# Altium schematic sheet E17-03-VCU.SchDoc
size A4
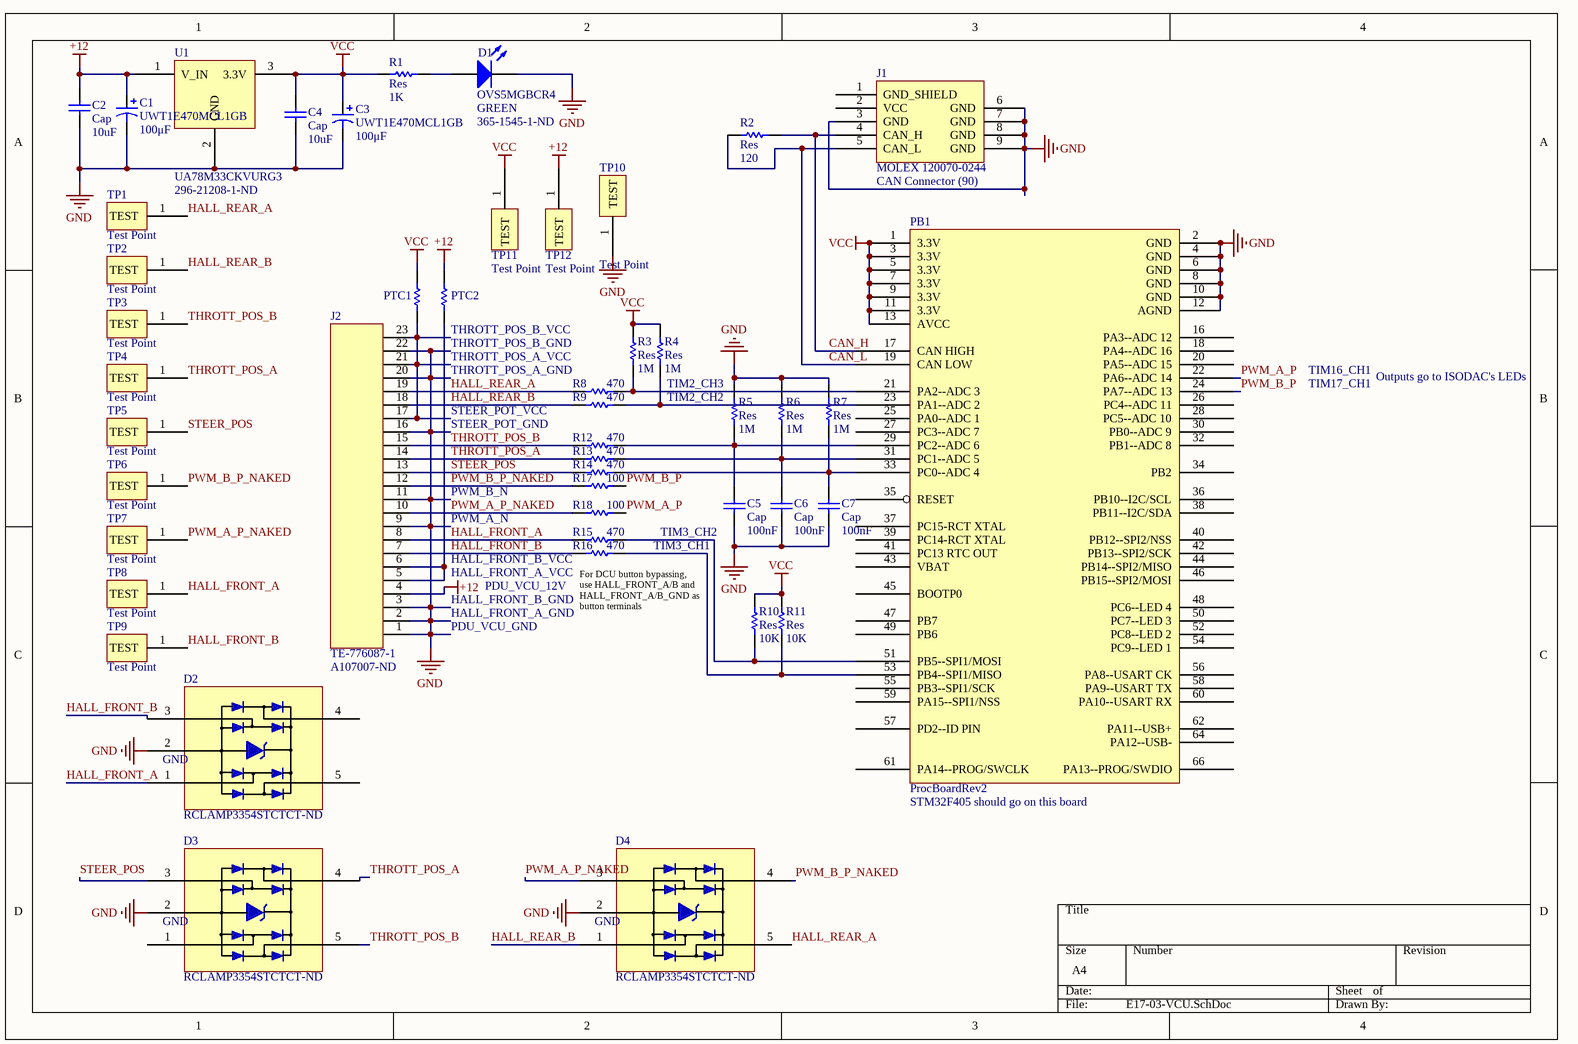
[diagram p0: E17-03-VCU.SchDoc]

## Parts
C1  UWT1E470MCL1GB  value 100μF  [UWT1E470MCL1GB]
C2  Cap  value 10uF  [C0805]
C3  UWT1E470MCL1GB  value 100μF  [UWT1E470MCL1GB]
C4  Cap  value 10uF  [C0805]
C5  Cap  value 100nF  [C0805]
C6  Cap  value 100nF  [C0805]
C7  Cap  value 100nF  [C0805]
D1  OVS5MGBCR4  Colour: GREEN  Supplier Part Number 1: 365-1545-1-ND  [OVS5MGBCR4]
D2  Supplier Part Number 1: RCLAMP3354STCTCT-ND  [SOT95P280X145-5N]  (hidden comment: RCLAMP3354S.TCT)
D3  Supplier Part Number 1: RCLAMP3354STCTCT-ND  [SOT95P280X145-5N]  (hidden comment: RCLAMP3354S.TCT)
D4  Supplier Part Number 1: RCLAMP3354STCTCT-ND  [SOT95P280X145-5N]  (hidden comment: RCLAMP3354S.TCT)
J1  CAN Connector (90)  [CAN Connector (90)]
J2  TE-776087-1  Supplier Part Number 1: A107007-ND  [TE-776087-1]
PB1  ProcBoardRev2  [PROC_BOARD]
PTC1  1206L075/16WR  [3216[1206]]  (value not drawn)
PTC2  1206L075/16WR  [3216[1206]]  (value not drawn)
R1  Res  value 1K  [2012[0805]]
R2  Res  value 120  [2012[0805]]
R3  Res  value 1M  [2012[0805]]
R4  Res  value 1M  [2012[0805]]
R5  Res  value 1M  [2012[0805]]
R6  Res  value 1M  [2012[0805]]
R7  Res  value 1M  [2012[0805]]
R8  value 470  [2012[0805]]  (hidden comment: Res)
R9  value 470  [2012[0805]]  (hidden comment: Res)
R10  Res  value 10K  [2012[0805]]
R11  Res  value 10K  [2012[0805]]
R12  value 470  [2012[0805]]  (hidden comment: Res)
R13  value 470  [2012[0805]]  (hidden comment: Res)
R14  value 470  [2012[0805]]  (hidden comment: Res)
R15  value 470  [2012[0805]]  (hidden comment: Res)
R16  value 470  [2012[0805]]  (hidden comment: Res)
R17  value 100  [2012[0805]]  (hidden comment: Res)
R18  value 100  [2012[0805]]  (hidden comment: Res)
TP1  Test Point  [TEST POINT 5000K]
TP2  Test Point  [TEST POINT 5000K]
TP3  Test Point  [TEST POINT 5000K]
TP4  Test Point  [TEST POINT 5000K]
TP5  Test Point  [TEST POINT 5000K]
TP6  Test Point  [TEST POINT 5000K]
TP7  Test Point  [TEST POINT 5000K]
TP8  Test Point  [TEST POINT 5000K]
TP9  Test Point  [TEST POINT 5000K]
TP10  Test Point  [TEST POINT 5000K]
TP11  Test Point  [TEST POINT 5000K]
TP12  Test Point  [TEST POINT 5000K]
U1  UA78M33CKVURG3  Supplier Part Number 1: 296-21208-1-ND  [TO-252-3]

## Nets
+12: C1.1 C2.2 J2.4 PTC2.2 TP12.1(TEST) U1.1(V_IN)
GND: C1.2 C2.1 C3.2 C4.1 C5.2 C6.2 C7.2 D1.2(K) D2.2(GND) D3.2(GND) D4.2(GND) J1.3(GND) J1.6(GND) J1.7(GND) J1.8(GND) J1.9(GND) J2.1 J2.2 J2.3 J2.9 J2.11 J2.16 J2.20 J2.22 PB1.2(GND) PB1.4(GND) PB1.6(GND) PB1.8(GND) PB1.10(GND) PB1.12(AGND) R5.2 R6.2 R7.2 TP10.1(TEST) U1.2(GND)
VCC: C3.1 C4.2 PB1.1(3.3V) PB1.3(3.3V) PB1.5(3.3V) PB1.7(3.3V) PB1.9(3.3V) PB1.11(3.3V) PB1.13(AVCC) PTC1.2 R1.2 R3.2 R4.2 R10.2 R11.2 TP11.1(TEST) U1.3(3.3V)
CAN_H: J1.4(CAN_H) PB1.17(CAN_HIGH) R2.1
CAN_L: J1.5(CAN_L) PB1.19(CAN_LOW) R2.2
HALL_FRONT_A: D2.1 J2.8 R15.1 TP8.1(TEST)
HALL_FRONT_B: D2.3 J2.7 R16.1 TP9.1(TEST)
HALL_REAR_A: D4.5 J2.19 R8.1 TP1.1(TEST)
HALL_REAR_B: D4.1 J2.18 R9.1 TP2.1(TEST)
PWM_A_P: PB1.22(PA6--ADC_14) R18.2
PWM_A_P_NAKED: D4.3 J2.10 R18.1 TP7.1(TEST)
PWM_B_P: PB1.24(PA7--ADC_13) R17.2
PWM_B_P_NAKED: D4.4 J2.12 R17.1 TP6.1(TEST)
STEER_POS: D3.3 J2.13 R14.1 TP5.1(TEST)
THROTT_POS_A: D3.4 J2.14 R13.1 TP4.1(TEST)
THROTT_POS_B: D3.5 J2.15 R12.1 TP3.1(TEST)
NetC5_1: C5.1 PB1.29(PC2--ADC_6) R5.1 R12.2
NetC6_1: C6.1 PB1.31(PC1--ADC_5) R6.1 R13.2
NetC7_1: C7.1 PB1.33(PC0--ADC_4) R7.1 R14.2
NetD1_1: D1.1(A) R1.1
NetJ2_5: J2.5 J2.6 PTC2.1
NetJ2_17: J2.17 J2.21 J2.23 PTC1.1
NetPB1_21: PB1.21(PA2--ADC_3) R3.1 R8.2
NetPB1_23: PB1.23(PA1--ADC_2) R4.1 R9.2
NetPB1_51: PB1.51(PB5--SPI1/MOSI) R10.1 R15.2
NetPB1_53: PB1.53(PB4--SPI1/MISO) R11.1 R16.2

Not connected (* = marked no-connect by the designer): D2 4 5; D3 1; J1 1(GND_SHIELD) 2(VCC); PB1 14(NC) 15(NC) 16(PA3--ADC_12) 18(PA4--ADC_16) 20(PA5--ADC_15) 25(PA0--ADC_1) 26(PC4--ADC_11) 27(PC3--ADC_7) 28(PC5--ADC_10) 30(PB0--ADC_9) 32(PB1--ADC_8) 34(PB2) 35(RESET) 36(PB10--I2C/SCL) 37(PC15-RCT_XTAL) 38(PB11--I2C/SDA) 39(PC14-RCT_XTAL) 40(PB12--SPI2/NSS) 41(PC13_RTC_OUT) 42(PB13--SPI2/SCK) 43(VBAT) 44(PB14--SPI2/MISO) 45(BOOTP0) 46(PB15--SPI2/MOSI) 47(PB7) 48(PC6--LED_4) 49(PB6) 50(PC7--LED_3) 52(PC8--LED_2) 54(PC9--LED_1) 55(PB3--SPI1/SCK) 56(PA8--USART_CK) 57(PD2--ID_PIN) 58(PA9--USART_TX) 59(PA15--SPI1/NSS) 60(PA10--USART_RX) 61(PA14--PROG/SWCLK) 62(PA11--USB+) 63(NC) 64(PA12--USB-) 65(NC) 66(PA13--PROG/SWDIO) 67

## Notes on the sheet
- THROTT_POS_A_VCC
- THROTT_POS_A_GND
- (near PTC2) THROTT_POS_B_VCC
- THROTT_POS_B_GND
- TIM2_CH3
- TIM16_CH1
- TIM17_CH1
- Outputs go to ISODAC's LEDs
- STEER_POT_VCC
- STEER_POT_GND
- TIM2_CH2
- PWM_A_N
- PWM_B_N
- HALL_FRONT_B_VCC
- HALL_FRONT_A_VCC
- PDU_VCU_12V
- TIM3_CH1
- TIM3_CH2
- PDU_VCU_GND
- HALL_FRONT_A_GND
- HALL_FRONT_B_GND
- (near R16) For DCU button bypassing, use HALL_FRONT_A/B and HALL_FRONT_A/B_GND as button terminals
- (near PB1) STM32F405 should go on this board
- (in symbol CAN Connector (90)) MOLEX 120070-0244

## Library data of the parts
C1 C3 = UWT1E470MCL1GB: CAP ALUM 47UF 25V 20% SMD; Published: 8-Jun-2000; LatestRevisionDate: 17-Jul-2002; LatestRevisionNote: Re-released for DXP Platform.; PackageReference: POLAR0.8; Publisher: Altium Limited; PackageDescription: Polarized Capacitor; 2 Leads
C2 C4-C7 = Cap: Capacitor; Published: 8-Jun-2000; LatestRevisionDate: 17-Jul-2002; LatestRevisionNote: Re-released for DXP Platform.; PackageReference: C1206; Publisher: Altium Limited
D1 = OVS5MGBCR4: Typical GREEN LED; Published: 8-Jun-2000; LatestRevisionDate: 17-Jul-2002; LatestRevisionNote: Re-released for DXP Platform.; PackageDocument: Feb-2002; PackageReference: 3.2X1.6X1.1; Publisher: Altium Limited; Supplier 1: Digi-Key
J2 = TE-776087-1: CONN HDR RTANG 23POS W/GASKT TIN; Supplier 1: Digi-Key
PB1 = ProcBoardRev2: Processor board that carries the STM32F072RB
PTC1 PTC2 = Res: Surface Mount Resistor; Value: 1K; Published: 8-Jun-2000; LatestRevisionDate: 17-Jul-2002; LatestRevisionNote: Re-released for DXP Platform.; PackageReference: AXIAL-0.5; Publisher: Altium Limited
R1-R18 = Res: Surface Mount Resistor; Published: 8-Jun-2000; LatestRevisionDate: 17-Jul-2002; LatestRevisionNote: Re-released for DXP Platform.; PackageReference: AXIAL-0.5; Publisher: Altium Limited
TP1-TP12 = Test Point: 5000-5004, 5015-5019 Keystone Electronics
U1 = UA78M33CKVURG3: 3.3V Regulator; Supplier 1: Digi-Key
D2-D4 = RCLAMP3354S.TCT: Supplier 1: Digi-Key
J1 = CAN Connector (90): Supplier 1: Mouser